# Altium schematic sheet 输出放大（6）.SchDoc
size A4
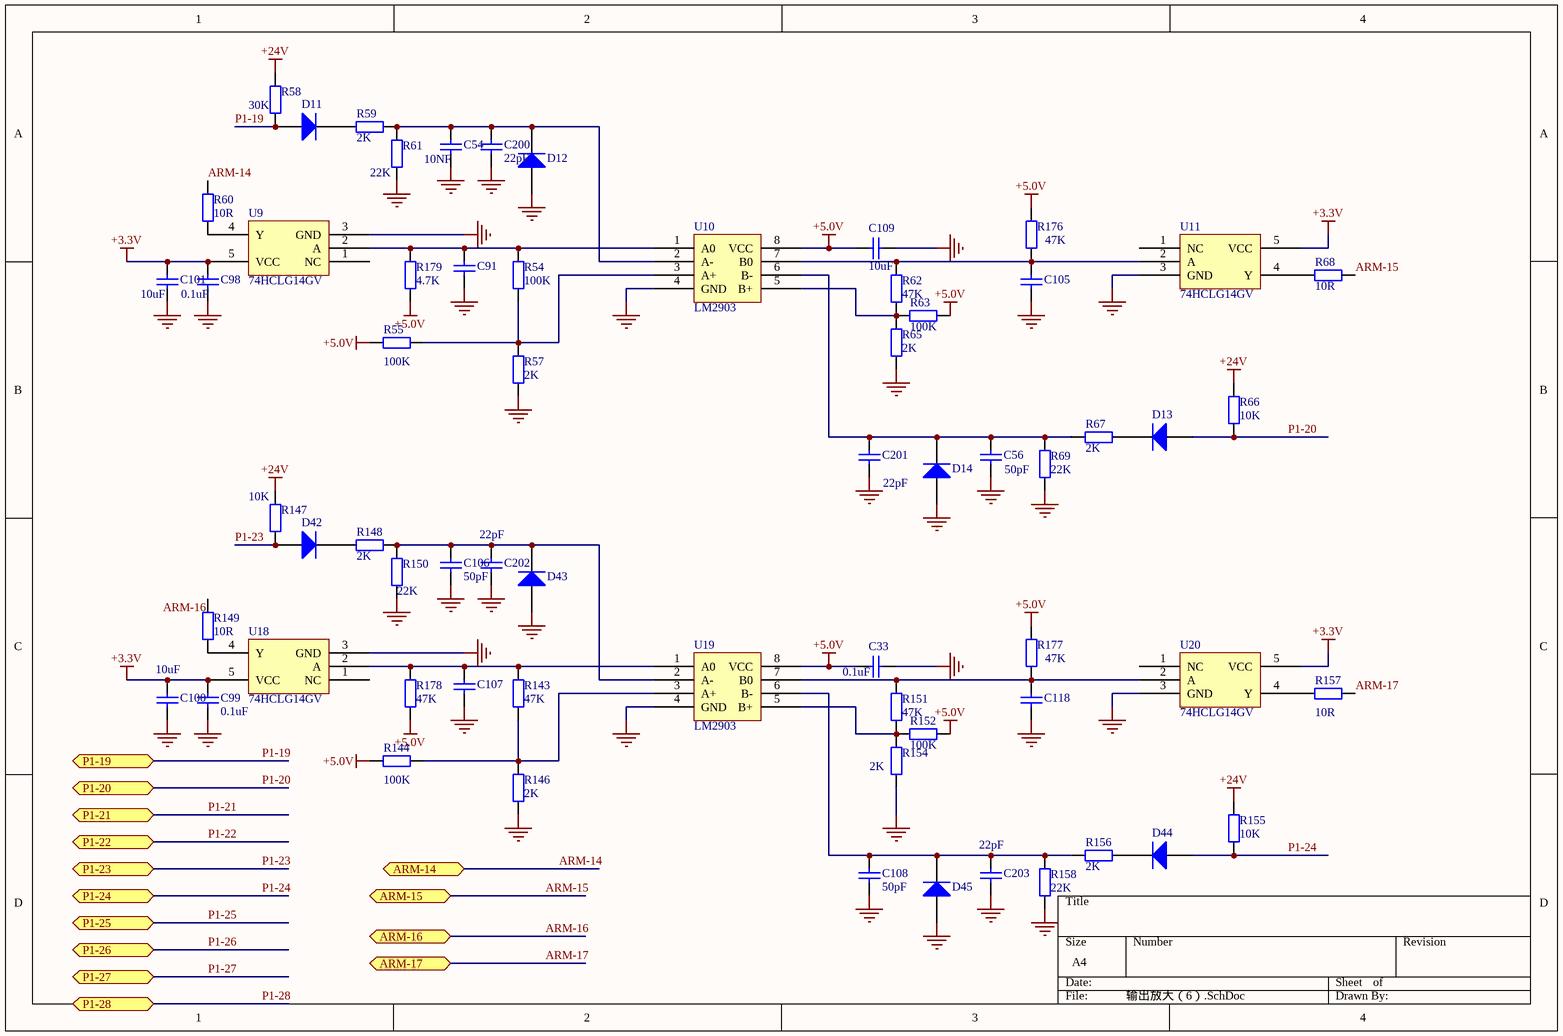
[diagram p0: 输出放大（6）.SchDoc]

## Parts
C33  value 0.1uF  [C0805]  (hidden comment: Cap)
C54  value 10NF  [C0805]  (hidden comment: Cap)
C56  value 50pF  [C0805]  (hidden comment: Cap)
C91  Cap  [C0805]  (value not drawn)
C98  value 0.1uF  [C0805]  (hidden comment: Cap)
C99  value 0.1uF  [C0805]  (hidden comment: Cap)
C100  value 10uF  [C1206]  (hidden comment: Cap)
C101  value 10uF  [C1206]  (hidden comment: Cap)
C105  Cap  [C0805]  (value not drawn)
C106  value 50pF  [C0805]  (hidden comment: Cap)
C107  Cap  [C0805]  (value not drawn)
C108  value 50pF  [C0805]  (hidden comment: Cap)
C109  value 10uF  [C1206]  (hidden comment: Cap)
C118  Cap  [C0805]  (value not drawn)
C200  value 22pF  [C0805]  (hidden comment: Cap)
C201  value 22pF  [C0805]  (hidden comment: Cap)
C202  value 22pF  [C0805]  (hidden comment: Cap)
C203  value 22pF  [C0805]  (hidden comment: Cap)
D11  Diode 1N4007  [SOD123]  (value not drawn)
D12  Diode 1N4007  [SOD123]  (value not drawn)
D13  Diode 1N4007  [SOD123]  (value not drawn)
D14  Diode 1N4007  [SOD123]  (value not drawn)
D42  Diode 1N4007  [SOD123]  (value not drawn)
D43  Diode 1N4007  [SOD123]  (value not drawn)
D44  Diode 1N4007  [SOD123]  (value not drawn)
D45  Diode 1N4007  [SOD123]  (value not drawn)
R54  value 100K  [R0805]  (hidden comment: Res2)
R55  value 100K  [R0805]  (hidden comment: Res2)
R57  value 2K  [R0805]  (hidden comment: Res2)
R58  value 30K  [R0805]  (hidden comment: Res2)
R59  value 2K  [R0805]  (hidden comment: Res2)
R60  value 10R  [R0805]  (hidden comment: Res2)
R61  value 22K  [R0805]  (hidden comment: Res2)
R62  value 47K  [R0805]  (hidden comment: Res2)
R63  value 100K  [R0805]  (hidden comment: Res2)
R65  value 2K  [R0805]  (hidden comment: Res2)
R66  value 10K  [R0805]  (hidden comment: Res2)
R67  value 2K  [R0805]  (hidden comment: Res2)
R68  value 10R  [R0805]  (hidden comment: Res2)
R69  value 22K  [R0805]  (hidden comment: Res2)
R143  value 47K  [R0805]  (hidden comment: Res2)
R144  value 100K  [R0805]  (hidden comment: Res2)
R146  value 2K  [R0805]  (hidden comment: Res2)
R147  value 10K  [R0805]  (hidden comment: Res2)
R148  value 2K  [R0805]  (hidden comment: Res2)
R149  value 10R  [R0805]  (hidden comment: Res2)
R150  value 22K  [R0805]  (hidden comment: Res2)
R151  value 47K  [R0805]  (hidden comment: Res2)
R152  value 100K  [R0805]  (hidden comment: Res2)
R154  value 2K  [R0805]  (hidden comment: Res2)
R155  value 10K  [R0805]  (hidden comment: Res2)
R156  value 2K  [R0805]  (hidden comment: Res2)
R157  value 10R  [R0805]  (hidden comment: Res2)
R158  value 22K  [R0805]  (hidden comment: Res2)
R176  value 47K  [R0805]  (hidden comment: Res2)
R177  value 47K  [R0805]  (hidden comment: Res2)
R178  value 47K  [R0805]  (hidden comment: Res2)
R179  value 4.7K  [R0805]  (hidden comment: Res2)
U9  74HCLG14GV  [SOT23-5]
U10  LM2903  [SO-8]
U11  74HCLG14GV  [SOT23-5]
U18  74HCLG14GV  [SOT23-5]
U19  LM2903  [SO-8]
U20  74HCLG14GV  [SOT23-5]

## Ports
ARM-14, ARM-15, ARM-16, ARM-17, P1-19, P1-20, P1-21, P1-22, P1-23, P1-24, P1-25, P1-26, P1-27, P1-28

## Nets
+3.3V: C98.2 C99.1 C100.2 C101.2 U9.5(VCC) U11.5(VCC) U18.5(VCC) U20.5(VCC)
+5.0V: C33.2 C109.1 R55.2 R63.2 R144.2 R152.2 R176.1 R177.1 R178.1 R179.1 U10.8(VCC) U19.8(VCC)
+24V: R58.2 R66.1 R147.2 R155.1
GND: C33.1 C54.1 C56.2 C91.2 C98.1 C99.2 C100.1 C101.1 C105.2 C106.2 C107.1 C108.1 C109.2 C118.1 C200.2 C201.2 C202.1 C203.2 D12.1(A) D14.1(A) D43.1(A) D45.1(A) R57.1 R61.1 R65.1 R69.2 R146.1 R150.1 R154.2 R158.2 U9.3(GND) U10.4(GND) U11.3(GND) U18.3(GND) U19.4(GND) U20.3(GND)
ARM-14: R60.1 ; port ARM-14
ARM-15: R68.1 ; port ARM-15
ARM-16: R149.1 ; port ARM-16
ARM-17: R157.2 ; port ARM-17
P1-19: D11.1(A) R58.1 ; port P1-19
P1-20: D13.1(A) R66.2 ; port P1-20
P1-21: port P1-21
P1-22: port P1-22
P1-23: D42.1(A) R147.1 ; port P1-23
P1-24: D44.1(A) R155.2 ; port P1-24
P1-25: port P1-25
P1-26: port P1-26
P1-27: port P1-27
P1-28: port P1-28
NetC54_2: C54.2 C200.1 D12.2(K) R59.2 R61.2 U10.2(A-)
NetC56_1: C56.1 C201.1 D14.2(K) R67.1 R69.1 U10.6(B-)
NetC91_1: C91.1 R54.1 R179.2 U9.2(A) U10.1(A0)
NetC105_1: C105.1 R62.2 R176.2 U10.7(B0) U11.2(A)
NetC106_1: C106.1 C202.2 D43.2(K) R148.2 R150.2 U19.2(A-)
NetC107_2: C107.2 R143.1 R178.2 U18.2(A) U19.1(A0)
NetC108_2: C108.2 C203.1 D45.2(K) R156.1 R158.1 U19.6(B-)
NetC118_2: C118.2 R151.2 R177.2 U19.7(B0) U20.2(A)
NetD11_2: D11.2(K) R59.1
NetD13_2: D13.2(K) R67.2
NetD42_2: D42.2(K) R148.1
NetD44_2: D44.2(K) R156.2
NetR54_2: R54.2 R55.1 R57.2 U10.3(A+)
NetR60_2: R60.2 U9.4(Y)
NetR62_1: R62.1 R63.1 R65.2 U10.5(B+)
NetR68_2: R68.2 U11.4(Y)
NetR143_2: R143.2 R144.1 R146.2 U19.3(A+)
NetR149_2: R149.2 U18.4(Y)
NetR151_1: R151.1 R152.1 R154.1 U19.5(B+)
NetR157_1: R157.1 U20.4(Y)

Not connected (* = marked no-connect by the designer): U9 1(NC); U11 1(NC); U18 1(NC); U20 1(NC)

## Library data of the parts
C33 C54 C56 C98-C101 C106 C108 C109 C200-C203 = Cap: Capacitor; Published: 8-Jun-2000; LatestRevisionDate: 17-Jul-2002; LatestRevisionNote: Re-released for DXP Platform.; PackageReference: RAD-0.3; Publisher: Altium Limited
C91 C105 C107 C118 = Cap: Capacitor; Value: NC; Published: 8-Jun-2000; LatestRevisionDate: 17-Jul-2002; LatestRevisionNote: Re-released for DXP Platform.; PackageReference: RAD-0.3; Publisher: Altium Limited
D11-D14 D42-D45 = Diode 1N4007: 1 Amp General Purpose Rectifier; Published: 8-Jun-2000; LatestRevisionDate: 17-Jul-2002; LatestRevisionNote: Re-released for DXP Platform.; DatasheetDocument: 1998; PackageDocument: Aug-1999; PackageReference: DO-41; Publisher: Altium Limited; Code_JEDEC: DO-204-AL; ComponentLink1Description: Manufacturer Link; ComponentLink1URL: http://www.fairchildsemi.com/; ComponentLink2Description: Datasheet; ComponentLink2URL: http://www.fairchildsemi.com/ds/1N%2F1N4001.pdf
R54 R55 R57-R63 R65-R69 R143 R144 R146-R152 R154-R158 R176-R179 = Res2: Resistor; Published: 8-Jun-2000; LatestRevisionDate: 17-Jul-2002; LatestRevisionNote: Re-released for DXP Platform.; PackageReference: AXIAL-0.4; Publisher: Altium Limited
U9-U11 U18-U20 = Component_1